# Altium schematic sheet MCU1.SchDoc
size 420 x 297 mm; Address1: Address1; Address2: Address2; Address3: Address3; Address4: Address4; SheetNumber: 2; SheetTotal: 4; Scale: 1:1; DocumentType: Схема электрическая принципиальная
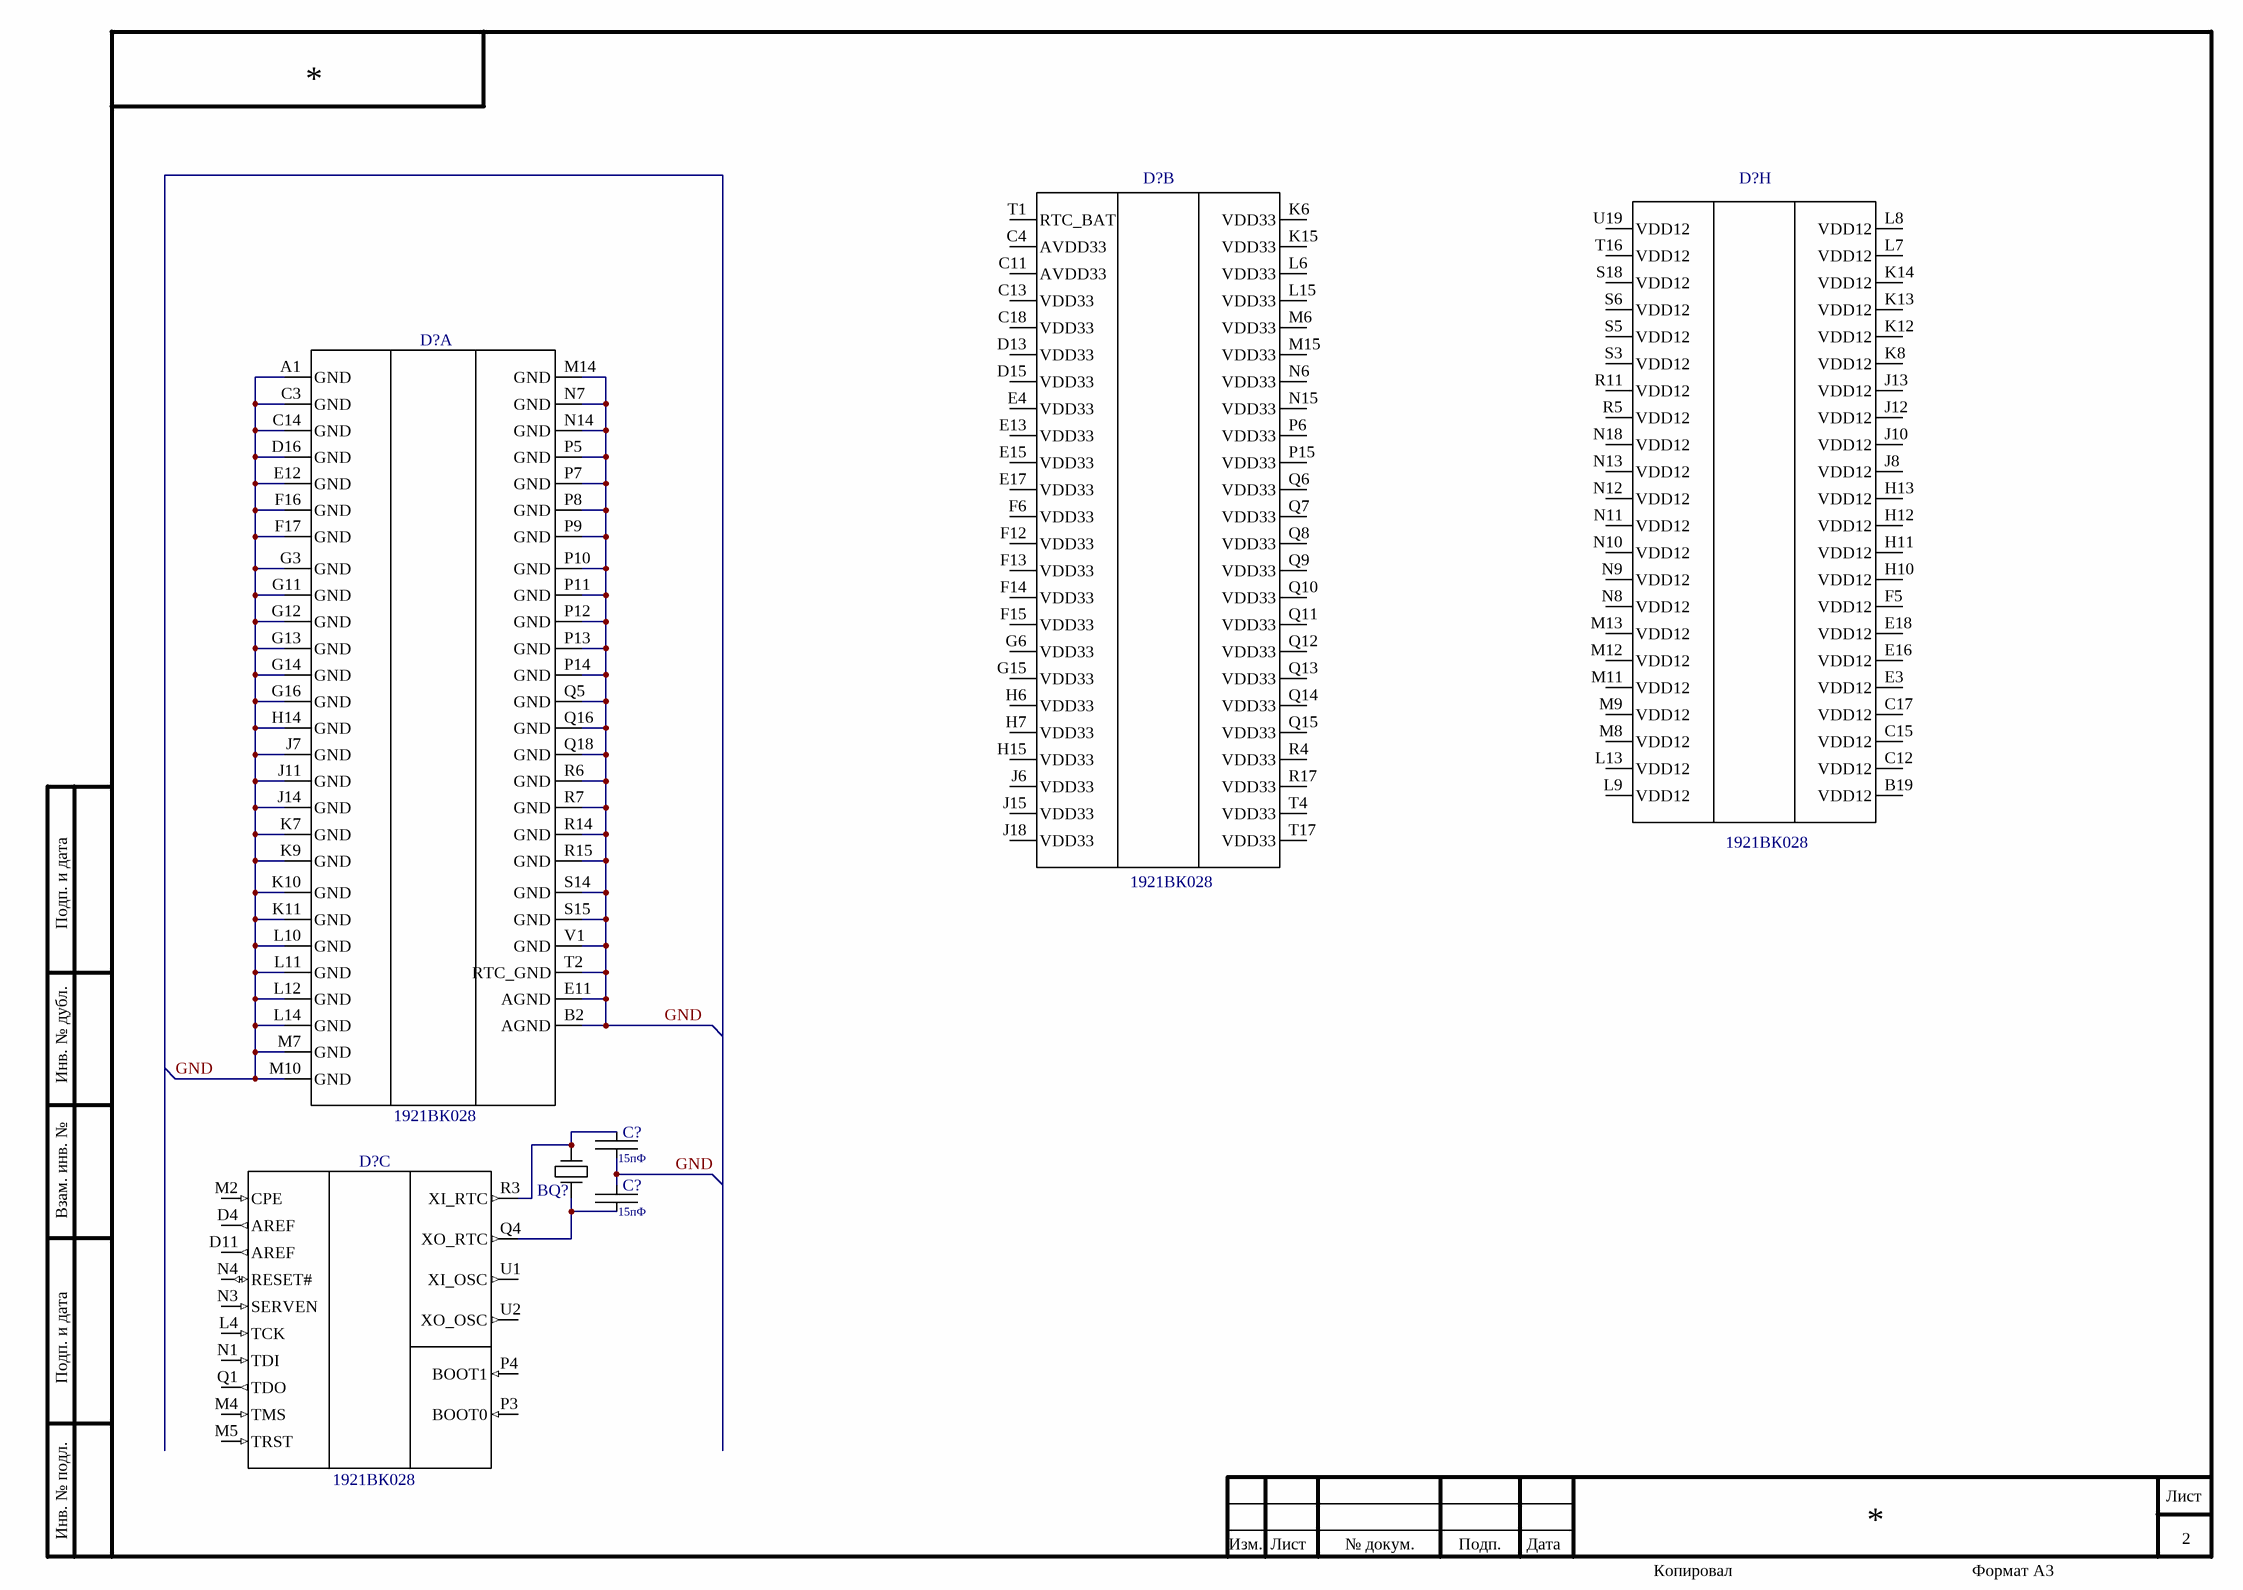
[diagram p0: MCU1.SchDoc]

## Parts
(Parts that share a designator on the sheet are numbered #1, #2 ... from top to bottom, then left to right.)
BQ?  РК206  (value not drawn)
C?#1  15пФ
C?#2  15пФ
D?#1  1921ВК028  (part H of 8)
D?#2  1921ВК028  (part B of 8)
D?#3  1921ВК028  (part A of 8)
D?#4  1921ВК028  (part C of 8)

## Nets
GND: C?#1.2 C?#2.1 D?#3.A1(GND) D?#3.B2(AGND) D?#3.C3(GND) D?#3.C14(GND) D?#3.D16(GND) D?#3.E11(AGND) D?#3.E12(GND) D?#3.F16(GND) D?#3.F17(GND) D?#3.G3(GND) D?#3.G11(GND) D?#3.G12(GND) D?#3.G13(GND) D?#3.G14(GND) D?#3.G16(GND) D?#3.H14(GND) D?#3.J7(GND) D?#3.J11(GND) D?#3.J14(GND) D?#3.K7(GND) D?#3.K9(GND) D?#3.K10(GND) D?#3.K11(GND) D?#3.L10(GND) D?#3.L11(GND) D?#3.L12(GND) D?#3.L14(GND) D?#3.M7(GND) D?#3.M10(GND) D?#3.M14(GND) D?#3.N7(GND) D?#3.N14(GND) D?#3.P5(GND) D?#3.P7(GND) D?#3.P8(GND) D?#3.P9(GND) D?#3.P10(GND) D?#3.P11(GND) D?#3.P12(GND) D?#3.P13(GND) D?#3.P14(GND) D?#3.Q5(GND) D?#3.Q16(GND) D?#3.Q18(GND) D?#3.R6(GND) D?#3.R7(GND) D?#3.R14(GND) D?#3.R15(GND) D?#3.S14(GND) D?#3.S15(GND) D?#3.T2(RTC_GND) D?#3.V1(GND)
NetBQ?_1: BQ?.1 C?#2.2 D?#4.Q4(XO_RTC)
NetBQ?_4: BQ?.4 C?#1.1 D?#4.R3(XI_RTC)

Not connected (* = marked no-connect by the designer): D?#1 B19(VDD12) C12(VDD12) C15(VDD12) C17(VDD12) E3(VDD12) E16(VDD12) E18(VDD12) F5(VDD12) H10(VDD12) H11(VDD12) H12(VDD12) H13(VDD12) J8(VDD12) J10(VDD12) J12(VDD12) J13(VDD12) K8(VDD12) K12(VDD12) K13(VDD12) K14(VDD12) L7(VDD12) L8(VDD12) L9(VDD12) L13(VDD12) M8(VDD12) M9(VDD12) M11(VDD12) M12(VDD12) M13(VDD12) N8(VDD12) N9(VDD12) N10(VDD12) N11(VDD12) N12(VDD12) N13(VDD12) N18(VDD12) R5(VDD12) R11(VDD12) S3(VDD12) S5(VDD12) S6(VDD12) S18(VDD12) T16(VDD12) U19(VDD12); D?#2 C4(AVDD33) C11(AVDD33) C13(VDD33) C18(VDD33) D13(VDD33) D15(VDD33) E4(VDD33) E13(VDD33) E15(VDD33) E17(VDD33) F6(VDD33) F12(VDD33) F13(VDD33) F14(VDD33) F15(VDD33) G6(VDD33) G15(VDD33) H6(VDD33) H7(VDD33) H15(VDD33) J6(VDD33) J15(VDD33) J18(VDD33) K6(VDD33) K15(VDD33) L6(VDD33) L15(VDD33) M6(VDD33) M15(VDD33) N6(VDD33) N15(VDD33) P6(VDD33) P15(VDD33) Q6(VDD33) Q7(VDD33) Q8(VDD33) Q9(VDD33) Q10(VDD33) Q11(VDD33) Q12(VDD33) Q13(VDD33) Q14(VDD33) Q15(VDD33) R4(VDD33) R17(VDD33) T1(RTC_BAT) T4(VDD33) T17(VDD33); D?#4 D4(AREF) D11(AREF) L4(TCK) M2(CPE) M4(TMS) M5(TRST) N1(TDI) N3(SERVEN) N4(RESET#) P3(BOOT0) P4(BOOT1) Q1(TDO) U1(XI_OSC) U2(XO_OSC)

## Notes on the sheet
- Подп. и дата
- Инв. № дубл.
- Взам. инв. №
- Инв. № подл.
- Изм.
- Лист
- № докум.
- Подп.
- Дата
- Копировал
- Формат А3

## Library data of the parts
BQ? = РК206: Кварцевый резонатор РК206 32кГц
C?#1 C?#2 = К10-69: Керамический чип-конденсатор серии К10-79; PartNumber: К10-69в-*-* В- * ± *% *; TypePrefix: C; TU: АЖЯР.673511.002ТУ; TUHolder: ОАО НИИ "ГИРИКОНД"; Value: *; PackegeType: *
D?#1-D?#4 = 1921ВК028: МК 1921ВК028